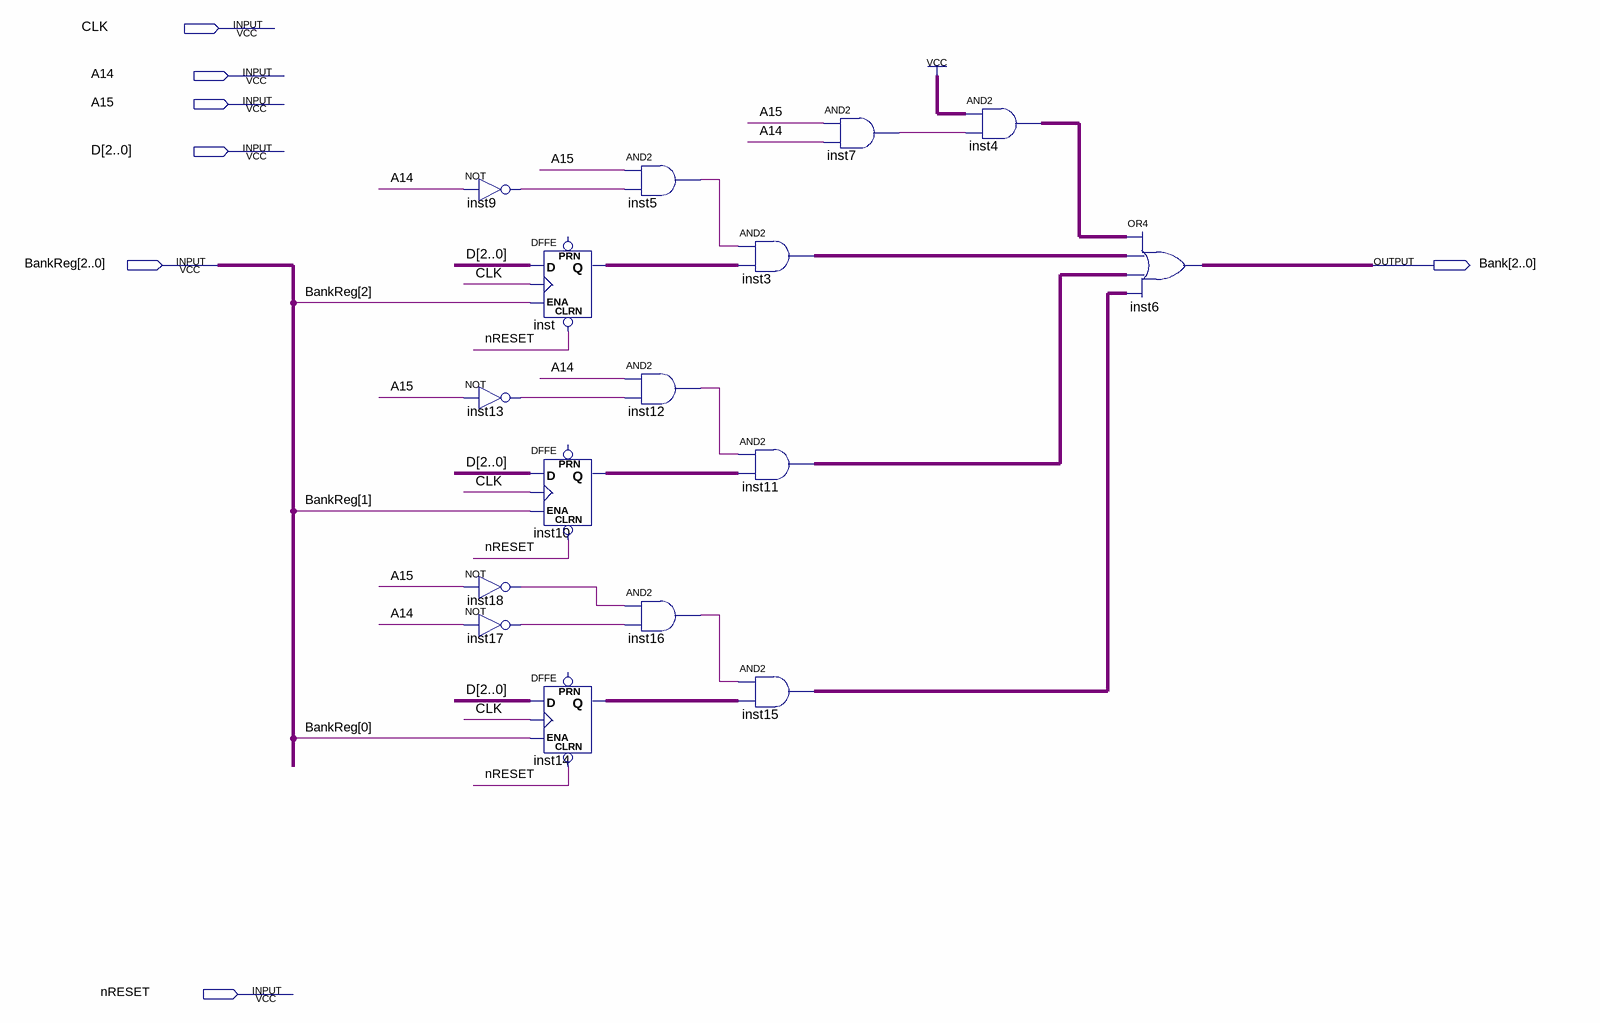
[diagram p0: schematic sheet]
// Quartus schematic BankReg.bdf as structural Verilog: 16 symbols, 7 pins
module BankReg (
  input  CLK,
  input  A14,
  input  A15,
  input  [2:0] D,
  input  [2:0] BankReg,
  input  nRESET,
  output [2:0] Bank
);

  wire inst5_out, inst7_out, inst9_out, inst12_out, inst13_out, inst16_out, inst17_out, inst18_out;
  wire [2:0] inst3_out, inst4_out, inst10_q, inst11_out, inst14_q, inst15_out, inst_q;

  not inst9 (inst9_out, A14);
  not inst13 (inst13_out, A15);
  not inst18 (inst18_out, A15);
  not inst17 (inst17_out, A14);
  DFFE inst[2:0] (.CLRN(nRESET), .D(D), .CLK(CLK), .ENA(BankReg[2]), .Q(inst_q));  // open: PRN
  DFFE inst10[2:0] (.CLRN(nRESET), .D(D), .CLK(CLK), .ENA(BankReg[1]), .Q(inst10_q));  // open: PRN
  DFFE inst14[2:0] (.CLRN(nRESET), .D(D), .CLK(CLK), .ENA(BankReg[0]), .Q(inst14_q));  // open: PRN
  and inst5 (inst5_out, A15, inst9_out);
  and inst12 (inst12_out, A14, inst13_out);
  and inst16 (inst16_out, inst18_out, inst17_out);
  assign inst3_out = {3{inst5_out}} & inst_q;  // AND2 inst3, 3 bits wide
  assign inst11_out = {3{inst12_out}} & inst10_q;  // AND2 inst11, 3 bits wide
  assign inst15_out = {3{inst16_out}} & inst14_q;  // AND2 inst15, 3 bits wide
  and inst7 (inst7_out, A15, A14);
  assign inst4_out = 3'b111 & {3{inst7_out}};  // AND2 inst4, 3 bits wide
  assign Bank = inst4_out | inst3_out | inst11_out | inst15_out;  // OR4 inst6, 3 bits wide
endmodule
